# EAGLE design DUCO Miner 5DN (EAGLE 9.6.2)
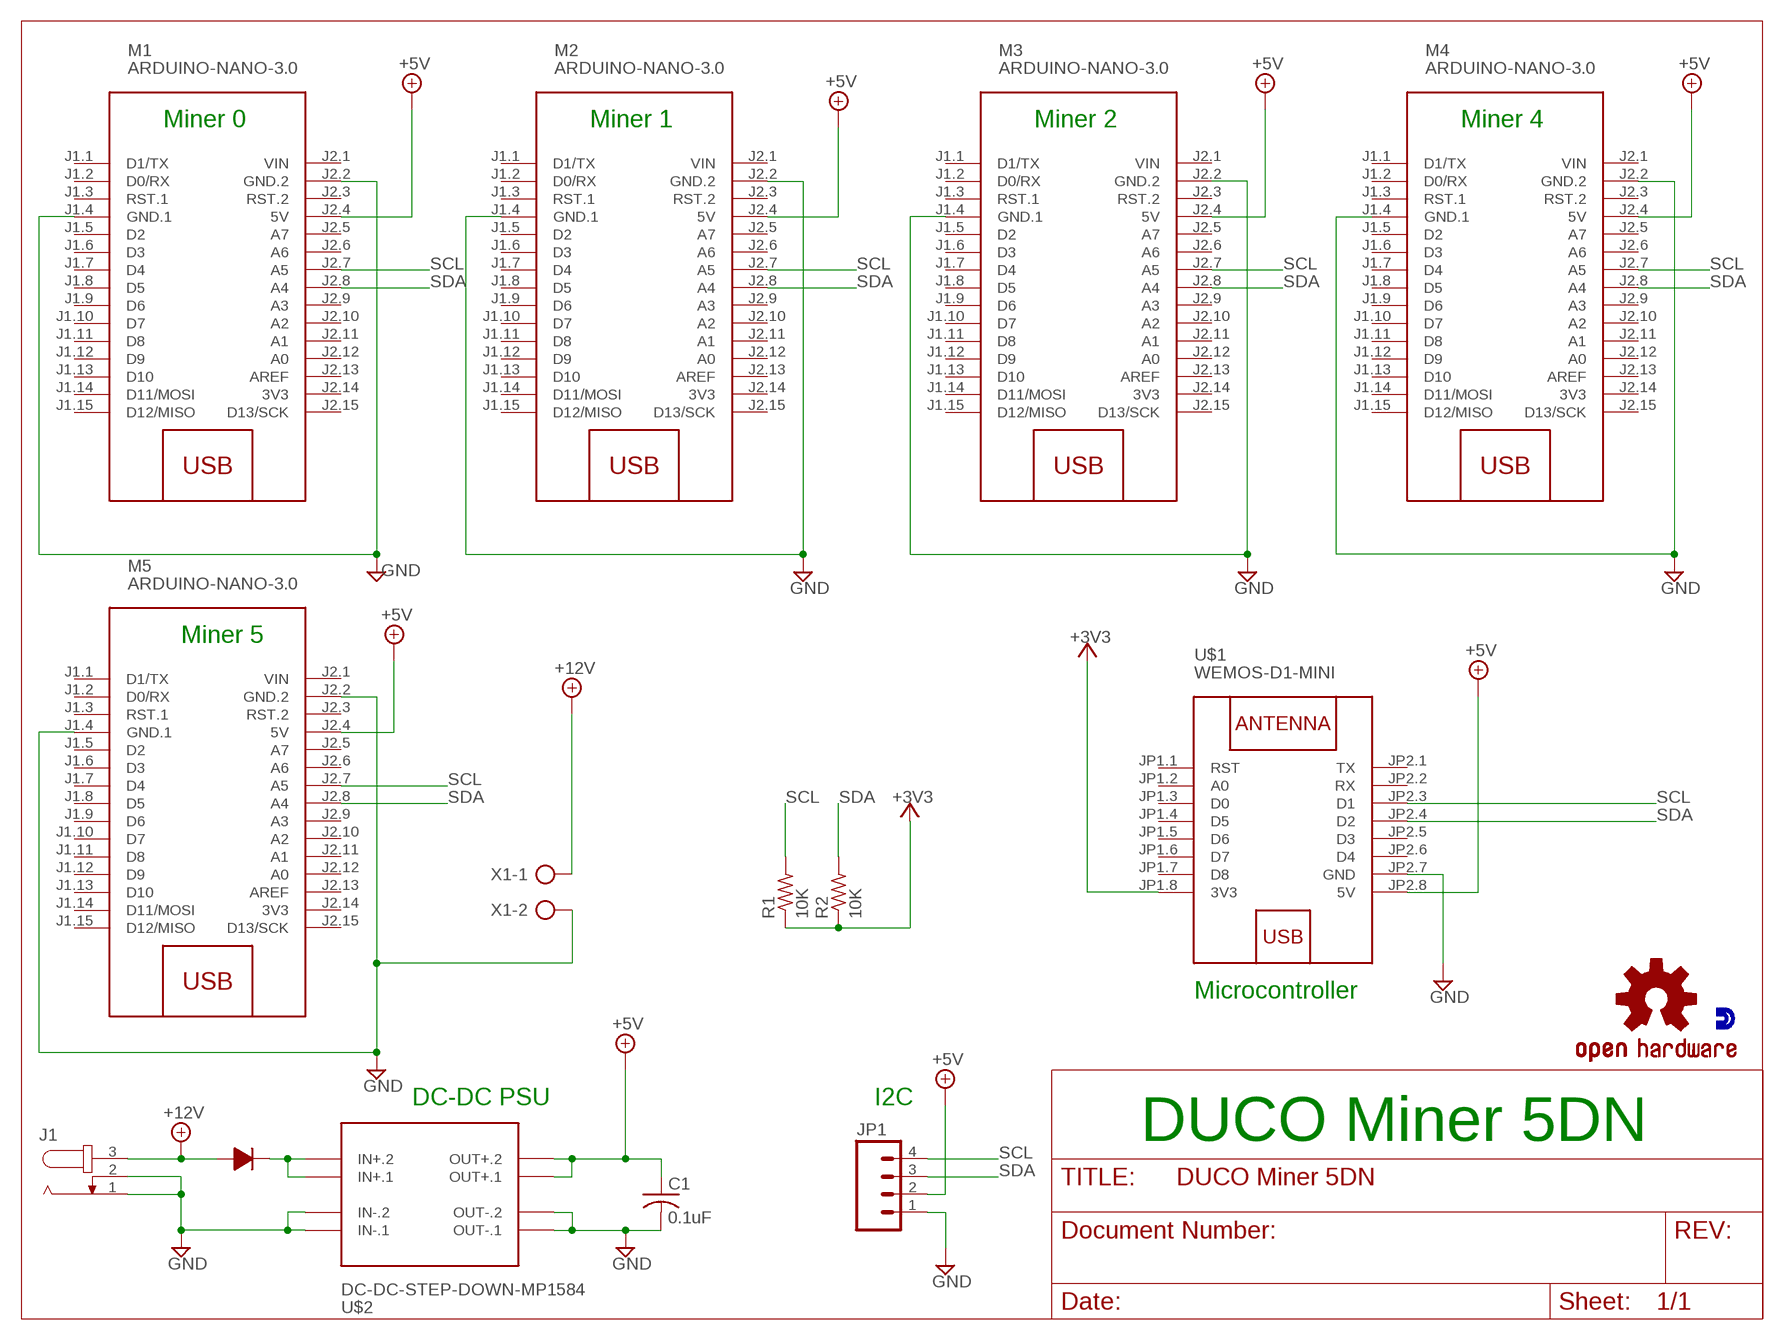
[diagram p0: schematic, sheet 1]

## Parts
C1  0.1uF  C-US025-025X050  [C025-025X050]
J1  JACK-PLUG1  [SPC4078]
JP1  M04PTH  [1X04]
LOGO1  OSHW-LOGOS  [OSHW-LOGO-S]
M1  ARDUINO-NANO-3.0  [ARDUINO-NANO-3.0]
M2  ARDUINO-NANO-3.0  [ARDUINO-NANO-3.0]
M3  ARDUINO-NANO-3.0  [ARDUINO-NANO-3.0]
M4  ARDUINO-NANO-3.0  [ARDUINO-NANO-3.0]
M5  ARDUINO-NANO-3.0  [ARDUINO-NANO-3.0]
R1  10K  R-US_0204/7  [0204/7]
R2  10K  R-US_0204/7  [0204/7]
U$1  WEMOS-D1-MINI  [WEMOS-D1-MINI]
U$2  DC-DC-STEP-DOWN-MP1584  [DC-DC-STEP-DOWN-MP1584]
U$4  1N4001  [DIODE-12.70]
X1  AK300/2  [AK300/2]

## Nets
+3V3: R1.1 R2.1 U$1.JP1.8(3V3)
+5V: C1.1 JP1.2 M1.J2.4(5V) M2.J2.4(5V) M3.J2.4(5V) M4.J2.4(5V) M5.J2.4(5V) U$1.JP2.8(5V) U$2.OUT+.1 U$2.OUT+.2
+12V: J1.3 U$4.P$1 X1.1
GND: C1.2 J1.1 J1.2 JP1.1 M1.J1.4(GND.1) M1.J2.2(GND.2) M2.J1.4(GND.1) M2.J2.2(GND.2) M3.J1.4(GND.1) M3.J2.2(GND.2) M4.J1.4(GND.1) M4.J2.2(GND.2) M5.J1.4(GND.1) M5.J2.2(GND.2) U$1.JP2.7(GND) U$2.IN-.1 U$2.IN-.2 U$2.OUT-.1 U$2.OUT-.2 X1.2
N$2: U$2.IN+.1 U$2.IN+.2 U$4.P$2
SCL: JP1.4 M1.J2.7(A5) M2.J2.7(A5) M3.J2.7(A5) M4.J2.7(A5) M5.J2.7(A5) R1.2 U$1.JP2.3(D1)
SDA: JP1.3 M1.J2.8(A4) M2.J2.8(A4) M3.J2.8(A4) M4.J2.8(A4) M5.J2.8(A4) R2.2 U$1.JP2.4(D2)
Unconnected: M1.J1.1(D1/TX) M1.J1.2(D0/RX) M1.J1.3(RST.1) M1.J1.5(D2) M1.J1.6(D3) M1.J1.7(D4) M1.J1.8(D5) M1.J1.9(D6) M1.J1.10(D7) M1.J1.11(D8) M1.J1.12(D9) M1.J1.13(D10) M1.J1.14(D11/MOSI) M1.J1.15(D12/MISO) M1.J2.3(RST.2) M1.J2.5(A7) M1.J2.6(A6) M1.J2.9(A3) M1.J2.10(A2) M1.J2.11(A1) M1.J2.12(A0) M1.J2.13(AREF) M1.J2.15(D13/SCK) M2.J1.1(D1/TX) M2.J1.2(D0/RX) M2.J1.3(RST.1) M2.J1.5(D2) M2.J1.6(D3) M2.J1.7(D4) M2.J1.8(D5) M2.J1.9(D6) M2.J1.10(D7) M2.J1.11(D8) M2.J1.12(D9) M2.J1.13(D10) M2.J1.14(D11/MOSI) M2.J1.15(D12/MISO) M2.J2.3(RST.2) M2.J2.5(A7) M2.J2.6(A6) M2.J2.9(A3) M2.J2.10(A2) M2.J2.11(A1) M2.J2.12(A0) M2.J2.13(AREF) M2.J2.15(D13/SCK) M3.J1.1(D1/TX) M3.J1.2(D0/RX) M3.J1.3(RST.1) M3.J1.5(D2) M3.J1.6(D3) M3.J1.7(D4) M3.J1.8(D5) M3.J1.9(D6) M3.J1.10(D7) M3.J1.11(D8) M3.J1.12(D9) M3.J1.13(D10) M3.J1.14(D11/MOSI) M3.J1.15(D12/MISO) M3.J2.3(RST.2) M3.J2.5(A7) M3.J2.6(A6) M3.J2.9(A3) M3.J2.10(A2) M3.J2.11(A1) M3.J2.12(A0) M3.J2.13(AREF) M3.J2.15(D13/SCK) M4.J1.1(D1/TX) M4.J1.2(D0/RX) M4.J1.3(RST.1) M4.J1.5(D2) M4.J1.6(D3) M4.J1.7(D4) M4.J1.8(D5) M4.J1.9(D6) M4.J1.10(D7) M4.J1.11(D8) M4.J1.12(D9) M4.J1.13(D10) M4.J1.14(D11/MOSI) M4.J1.15(D12/MISO) M4.J2.3(RST.2) M4.J2.5(A7) M4.J2.6(A6) M4.J2.9(A3) M4.J2.10(A2) M4.J2.11(A1) M4.J2.12(A0) M4.J2.13(AREF) M4.J2.15(D13/SCK) M5.J1.1(D1/TX) M5.J1.2(D0/RX) M5.J1.3(RST.1) M5.J1.5(D2) M5.J1.6(D3) M5.J1.7(D4) M5.J1.8(D5) M5.J1.9(D6) M5.J1.10(D7) M5.J1.11(D8) M5.J1.12(D9) M5.J1.13(D10) M5.J1.14(D11/MOSI) M5.J1.15(D12/MISO) M5.J2.3(RST.2) M5.J2.5(A7) M5.J2.6(A6) M5.J2.9(A3) M5.J2.10(A2) M5.J2.11(A1) M5.J2.12(A0) M5.J2.13(AREF) M5.J2.15(D13/SCK) U$1.JP1.1(RST) U$1.JP1.2(A0) U$1.JP1.3(D0) U$1.JP1.4(D5) U$1.JP1.5(D6) U$1.JP1.6(D7) U$1.JP1.7(D8) U$1.JP2.1(TX) U$1.JP2.2(RX) U$1.JP2.5(D3) U$1.JP2.6(D4)

## Notes on the sheet
- Miner 0 | Miner 1 | Miner 2 | Miner 4
- Miner 5
- Microcontroller
- DC-DC PSU | I2C
- DUCO Miner 5DN
- /home/g7ltt/Filestore/circuits/Duino Coin Miner/duino coin logo.bmp

## Power pins joined to a net without a drawn wire
3V3: M1.J2.14(3V3) M2.J2.14(3V3) M3.J2.14(3V3) M4.J2.14(3V3) M5.J2.14(3V3)
VIN: M1.J2.1(VIN) M2.J2.1(VIN) M3.J2.1(VIN) M4.J2.1(VIN) M5.J2.1(VIN)

## Library data of the parts
C1 = rcl:C-US: CAPACITOR, American symbol; SPICEPREFIX: C
J1 = con-jack:JACK-PLUG: DC POWER JACK Power Jack, DC, Right Angle, Through Hole, Rated 5A at 16VDC, PC Terminals Distributor: Farnell (www.Farnell.de) Drawing: 84N1161.pdf / 84N1162.pdf Manufacturer: SPC Technology (www.spctechnology.com) Type: SPC4077 / SPC 4078; OC_FARNELL: unknown; OC_NEWARK: unknown
JP1 = SparkFun:M04: Header 4 Standard 4-pin 0.1" header. Use with straight break away headers (SKU : PRT-00116), right angle break away headers (PRT-00553), swiss pins (PRT-00743), machine pins (PRT-00117), and female headers (PRT-00115). Molex polarized connector foot print use with SKU : PRT-08231 with associated crimp pins and housings. 1MM SMD Version SKU: PRT-10208
LOGO1 = SparkFun-Aesthetics:OSHW-LOGO: Open Source Hardware Logo This logo indicates the piece of hardware it is found on incorporates a OSHW license and/or adheres to the definition of open source hardware found here: http://freedomdefined.org/OSHW
M1-M5 = diy-modules:ARDUINO-NANO-3.0: Arduino Nano 3.0 and compatible devices More details available here: https://www.arduino.cc/en/Main/ArduinoBoardNano Click here to find device on ebay.com <http://www.ebay.com/sch/arduino+nano>
R1 R2 = rcl:R-US_: RESISTOR, American symbol; SPICEPREFIX: R
U$1 = diy-modules:WEMOS-D1-MINI: WEMOS D1 mini: Mini Wi-Fi Board based on ESP-8266 device More details can be found here: https://www.wemos.cc/product/d1-mini.html Click here to find device on ebay.com <http://www.ebay.com/sch/wemos+d1+mini+nodemcu>
U$2 = diy-modules:DC-DC-STEP-DOWN-MP1584: DC/DC Step-Down Regulator based on MP1584 chip MP1584 datasheet available here: http://www.haoyuelectronics.com/Attachment/MP1584/MP1584.pdf Click here to find device on ebay.com <http://www.ebay.com/sch/mp1584+module>
U$4 = Oles komponentbibliotek:1N4001: 1N4001 diode
X1 = con-ptr500:AK300/2: CONNECTOR; OC_FARNELL: unknown; OC_NEWARK: unknown

## Board
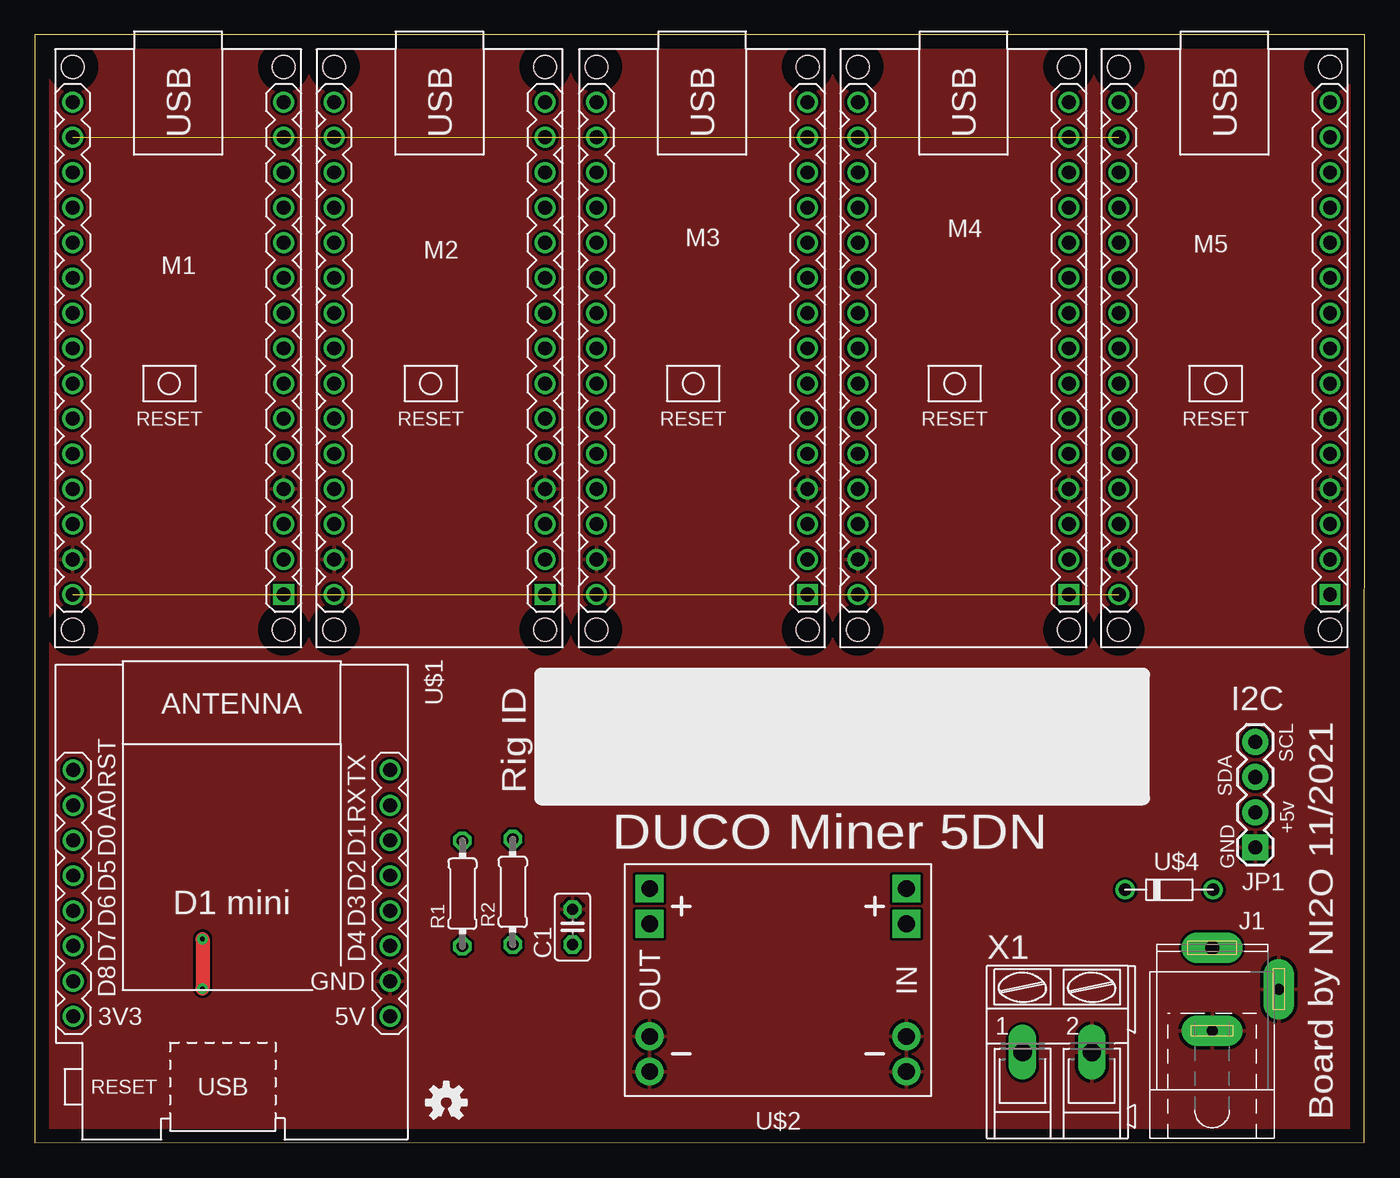
[diagram p1: board, top side]
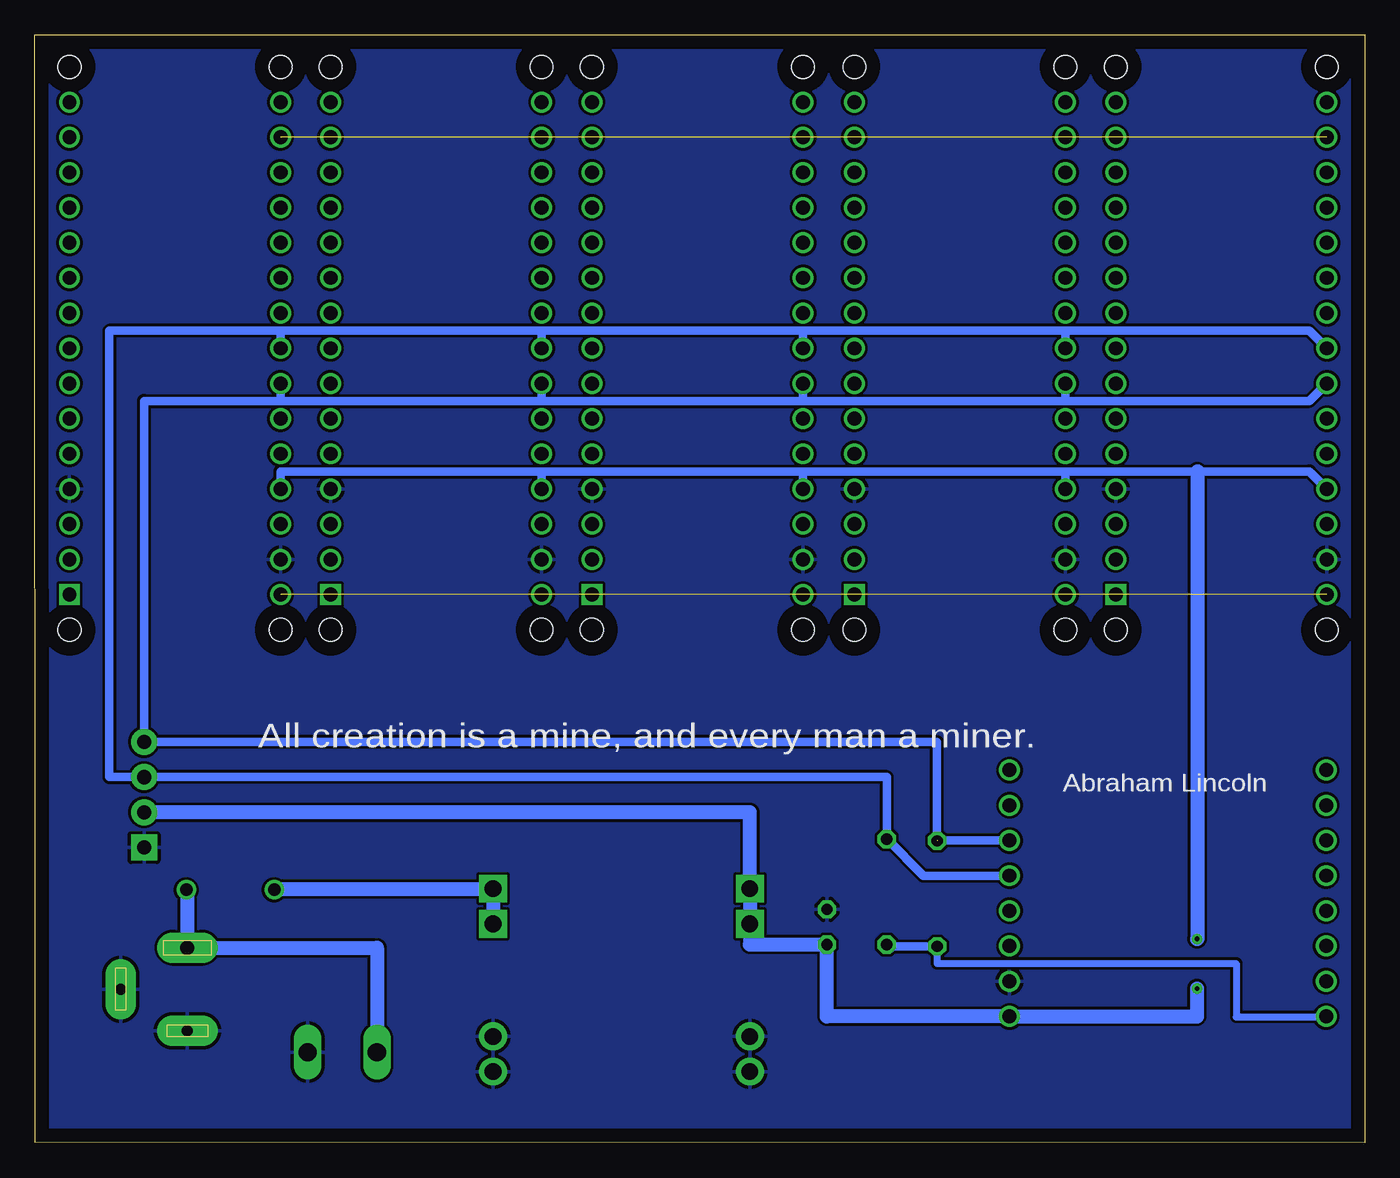
[diagram p2: board, bottom side, seen from below]

Size 96.04 x 80.03 mm. Coordinates in mm from the lower left corner, seen from the top.
Outline: 0,0 95.99,0.05 96.04,80.03 0,80 0,0
Copper layers (1*16): Top 0.035mm / dielectric 1.5mm / Bottom 0.035mm
Design rules "default": minimum track width 10mil, minimum drill 24mil, track to track 8mil, track to pad 8mil, pad to pad 8mil, via to via 8mil, smd to smd 8mil, copper to edge 40mil, drill to drill 8mil, minimum pad ring 10mil, minimum via ring 8mil, stop-mask expansion 4mil, vias tented up to drill 0mil, thermal gap 10mil

### Footprints (pad centres in the part's own frame; a part is rotated, then mirrored left to right if it is on the bottom)
C025-025X050 = drill 0.813 octagon: 1 -1.27,0; 2 1.27,0
SPC4078 = drill 0.8 pad 2.184 long: 1 -3,0; 2 0,-4.8 | drill 1 pad 2.184 long: 3 3,0
1X04 = drill 1.016 pad 1.88 square: 1 0,0 | drill 1.016 pad 1.88: 2 2.54,0; 3 5.08,0; 4 7.62,0
ARDUINO-NANO-3.0 = drill 1 square: J1.1 17.78,7.62 | drill 1: J1.2 15.24,7.62; J1.3 12.7,7.62; J1.4 10.16,7.62; J1.5 7.62,7.62; J1.6 5.08,7.62; J1.7 2.54,7.62; J1.8 0,7.62; J1.9 -2.54,7.62; J1.10 -5.08,7.62; J1.11 -7.62,7.62; J1.12 -10.16,7.62; J1.13 -12.7,7.62; J1.14 -15.24,7.62; J1.15 -17.78,7.62; J2.1 17.78,-7.62; J2.2 15.24,-7.62; J2.3 12.7,-7.62; J2.4 10.16,-7.62; J2.5 7.62,-7.62; J2.6 5.08,-7.62; J2.7 2.54,-7.62; J2.8 0,-7.62; J2.9 -2.54,-7.62; J2.10 -5.08,-7.62; J2.11 -7.62,-7.62; J2.12 -10.16,-7.62; J2.13 -12.7,-7.62; J2.14 -15.24,-7.62; J2.15 -17.78,-7.62 | hole 1.651: -20.32,7.62; -20.32,-7.62; 20.32,-7.62; 20.32,7.62
0204/7 = drill 0.813 octagon: 1 -3.81,0; 2 3.81,0
WEMOS-D1-MINI = drill 1: JP1.1 -11.43,9.525; JP1.2 -11.43,6.985; JP1.3 -11.43,4.445; JP1.4 -11.43,1.905; JP1.5 -11.43,-0.635; JP1.6 -11.43,-3.175; JP1.7 -11.43,-5.715; JP1.8 -11.43,-8.255; JP2.1 11.43,9.525; JP2.2 11.43,6.985; JP2.3 11.43,4.445; JP2.4 11.43,1.905; JP2.5 11.43,-0.635; JP2.6 11.43,-3.175; JP2.7 11.43,-5.715; JP2.8 11.43,-8.255
DC-DC-STEP-DOWN-MP1584 = drill 1.2 pad 2 square: IN+.1 -9.271,-4.064; IN+.2 -9.271,-6.604; OUT+.1 9.271,-4.064; OUT+.2 9.271,-6.604 | drill 1.2 pad 2: IN-.1 -9.271,6.604; IN-.2 -9.271,4.064; OUT-.1 9.271,6.604; OUT-.2 9.271,4.064
DIODE-12.70 = drill 0.9: P$1 -3.81,0; P$2 2.54,0
AK300/2 = drill 1.321 long: 1 -2.515,0; 2 2.489,0

### Placement (x,y rotation side)
C1  38.84,15.6 90 top
J1  85.01,11.1 90 top
JP1  88.14,21.34 90 top
LOGO1  29.72,2.92 0 top
M1  10.36,57.38 270 top
M2  29.24,57.38 270 top
M3  48.18,57.38 270 top
M4  67.06,57.38 270 top
M5  85.9,57.38 270 top
R1  30.89,18.01 90 top
R2  34.52,18.14 90 top
U$1  14.22,17.4 0 top
U$2  53.67,11.76 180 top
U$4  81.28,18.29 180 top
X1  73.84,6.55 0 top

### Tracks (layer width: path | path; a pad name or v marks a point on that pad's centre or on a via)
3V3  (4 unrouted)
+3V3
  Bottom 0.508: R1.1 30.89,12.95 9.3,12.95 9.3,9.09 2.79,9.09 U$1.JP1.8
  Bottom 0.61: 34.39,14.2 R1.1
  Bottom 1.016: R2.1 34.39,14.2
+5V  (via drill 0.35)
  Top 1.016: v12.12,14.73 v12.12,11.15
  Bottom 0.61: M1.J2.4 4.01,48.49 12.09,48.49 21.61,48.49 | M5.J2.4 78.28,48.49 59.44,48.49 | 59.44,48.49 40.56,48.49 | 40.56,48.49 21.61,48.49 | M2.J2.4 21.61,48.49 | M3.J2.4 40.56,48.49 | M4.J2.4 59.44,48.49
  Bottom 1.016: JP1.2 44.4,23.88 U$2.OUT+.2 U$2.OUT+.1 44.4,14.33 C1.1 38.84,9.14 U$1.JP2.8 12.12,9.14 v12.12,11.15 | v12.12,14.73 12.09,14.76 12.09,48.49
+12V
  Bottom 1.016: U$4.P$1 85.01,18.21 J1.3 71.32,14.1 X1.1
GND
  pour Top: 96.06,0.04 96.06,80.04 0,80.04 0,0.3
  pour Bottom: 0,0.08 0,80.01 95.96,80.01 95.96,0.08
N$2
  Bottom 1.016: U$4.P$2 78.66,18.36 U$2.IN+.2 U$2.IN+.1
SCL  (1 unrouted)
  Bottom 0.61: U$1.JP2.3 30.86,21.84 | M1.J2.7 4.01,53.57 21.61,53.57 | 78.28,53.57 88.14,53.57 JP1.4 30.89,28.96 R1.2 | 78.28,53.57 59.44,53.57 | 59.44,53.57 40.56,53.57 | 40.56,53.57 21.61,53.57 | M5.J2.7 78.28,53.57 | M4.J2.7 59.44,53.57 | M3.J2.7 40.56,53.57 | M2.J2.7 21.61,53.57
SDA
  Bottom 0.61: U$1.JP2.4 31.88,19.3 R2.2 34.52,26.42 JP1.3 90.65,26.42 90.65,58.65 78.28,58.65 | M1.J2.8 4.01,58.65 21.61,58.65 | 21.61,58.65 40.56,58.65 | 40.56,58.65 59.44,58.65 | 59.44,58.65 78.28,58.65 | M2.J2.8 21.61,58.65 | M3.J2.8 40.56,58.65 | M4.J2.8 59.44,58.65 | M5.J2.8 78.28,58.65
  Bottom 1.016: R2.2 34.47,22
VIN  (4 unrouted)

### Text on the board
tNames: I2C | SCL | Rig ID | SDA | +5v | DUCO Miner 5DN | GND | Board by NI2O 11/2021
bNames: All creation is a mine, and every man a miner. | Abraham Lincoln
201bmp: /home/g7ltt/Filestore/circuits/Duino Coin Miner/duino coin logo.bmp